# EasyEDA schematic SCH_MULTIVIBRATOR_Task-1_2021-06-30.json
TITLE: Multivibrator; REV: 1.0; Date: 2021-06-24; Sheet: 1/1; Drawn By: susilbehera486; Company: Your Company
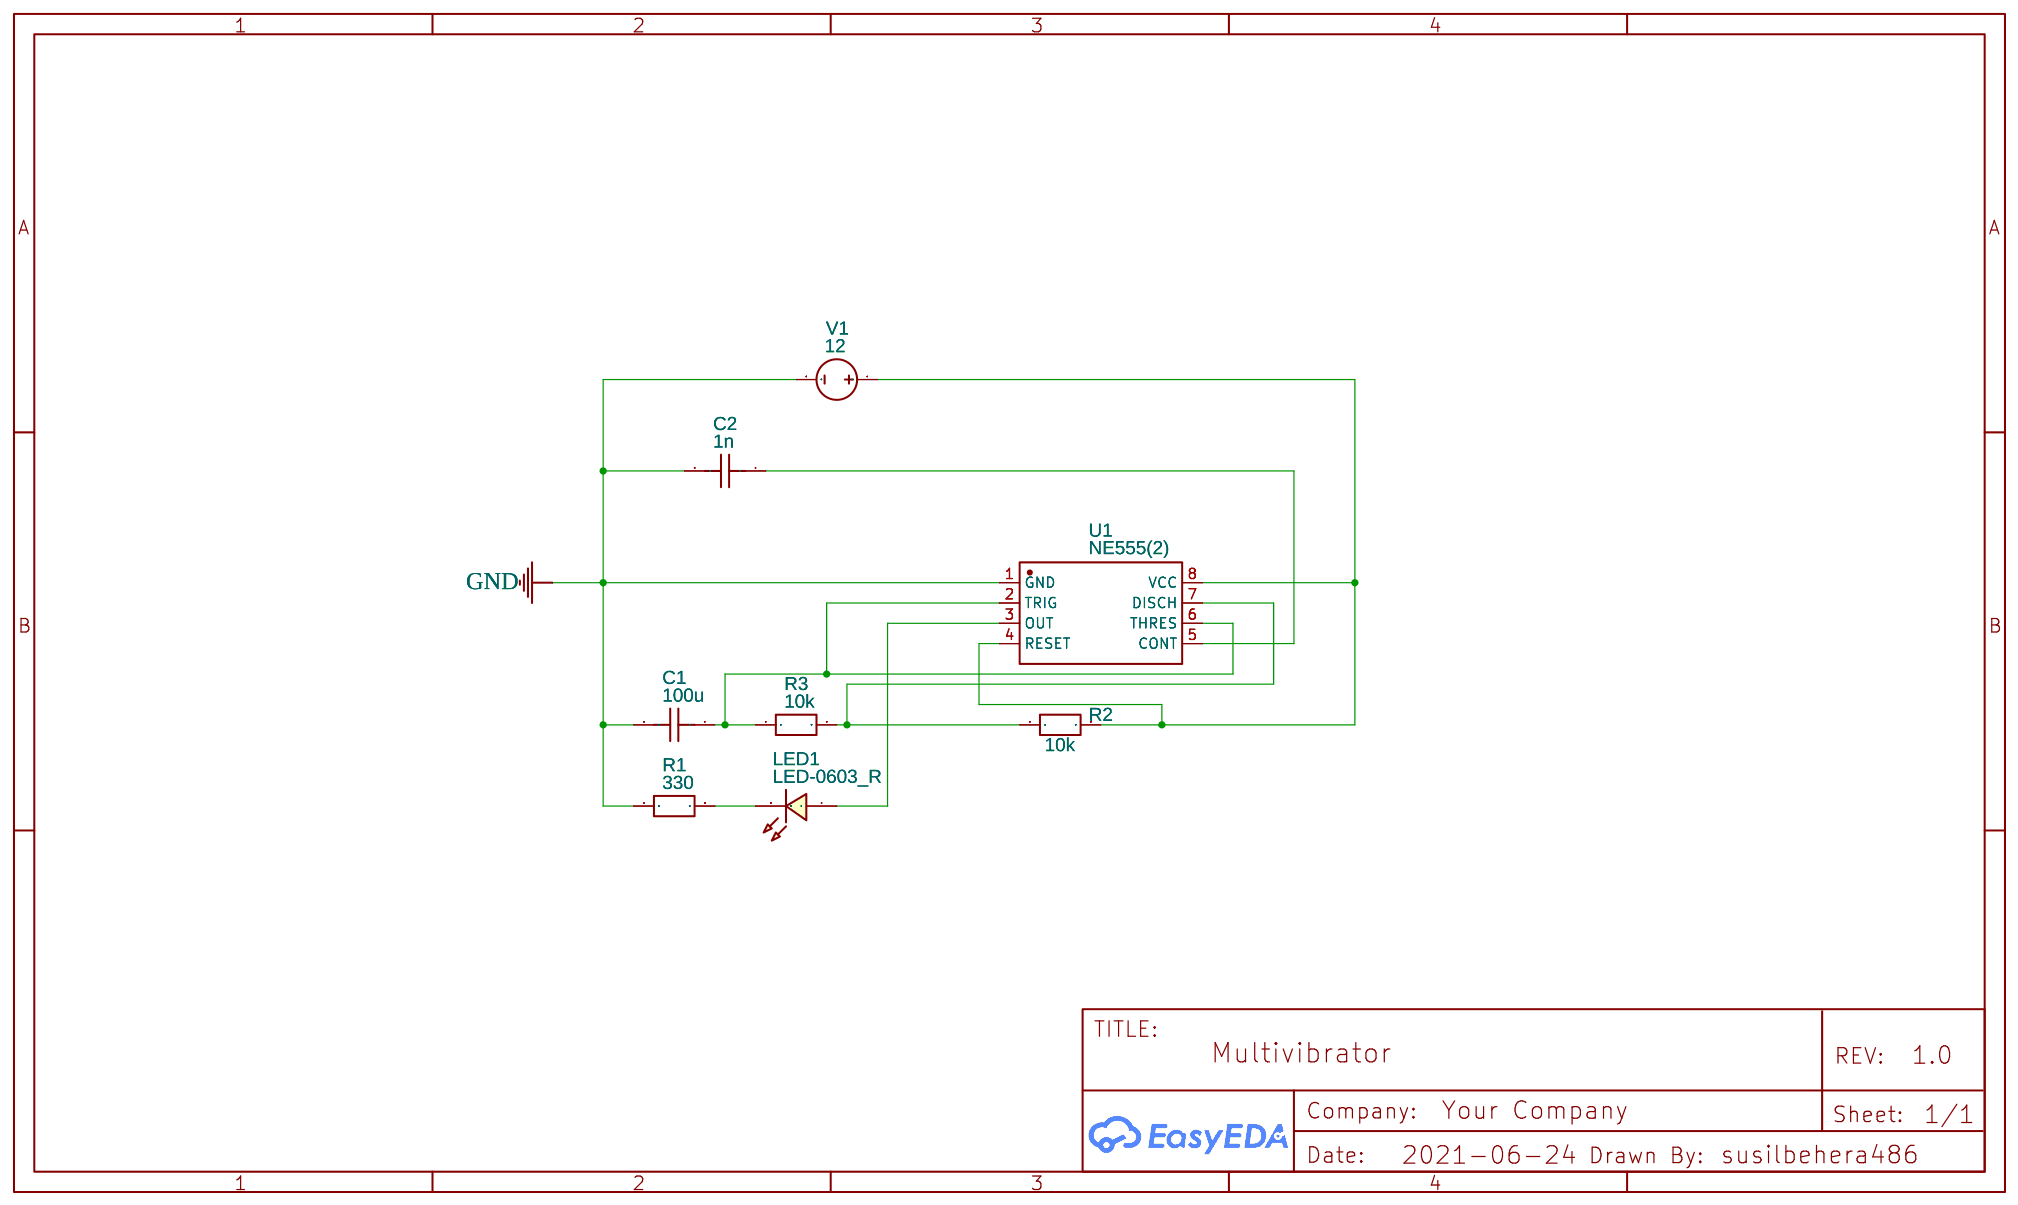
[diagram p0: schematic sheet]

## Parts
C1  100u  [C0603]
C2  1n  [C0603]
LED1  LED-0603_R  [LED0603_RED]
R1  330  [R0603]
R2  10k  [R0603]
R3  10k  [R0603]
U1  NE555(2)  [SOP_8(2)]
V1  12  [HDR1X2]

## Library data of the parts
C1 C2 = C_0603_US: Contributor: LCEDA_Lib
LED1 = LED-0603_R: Manufacturer: EVERLIGHT(台湾亿光); Manufacturer Part: 19-217/R6C-AL1M2VY/3T; Supplier Part: C72044; Supplier: LCSC; Contributor: LCEDA_01
R1-R3 = R_0603_EU: Contributor: LCEDA_Lib
U1 = NE555(2): Contributor: susil Kumar behera
V1 = VDC: Contributor: EasyEDA; sim: true

## Nets
GND: C1.2 C2.2 R1.1 U1.1(GND) V1.2
Net-(C1-1): C1.1 R3.1 U1.2(TRIG) U1.6(THRES)
Net-(C2-1): C2.1 U1.5(CONT)
Net-(LED1-1): LED1.1 U1.3(OUT)
Net-(LED1-2): LED1.2 R1.2
Net-(R2-1): R2.1 R3.2 U1.7(DISCH)
Net-(R2-2): R2.2 U1.4(RESET) U1.8(VCC) V1.1
